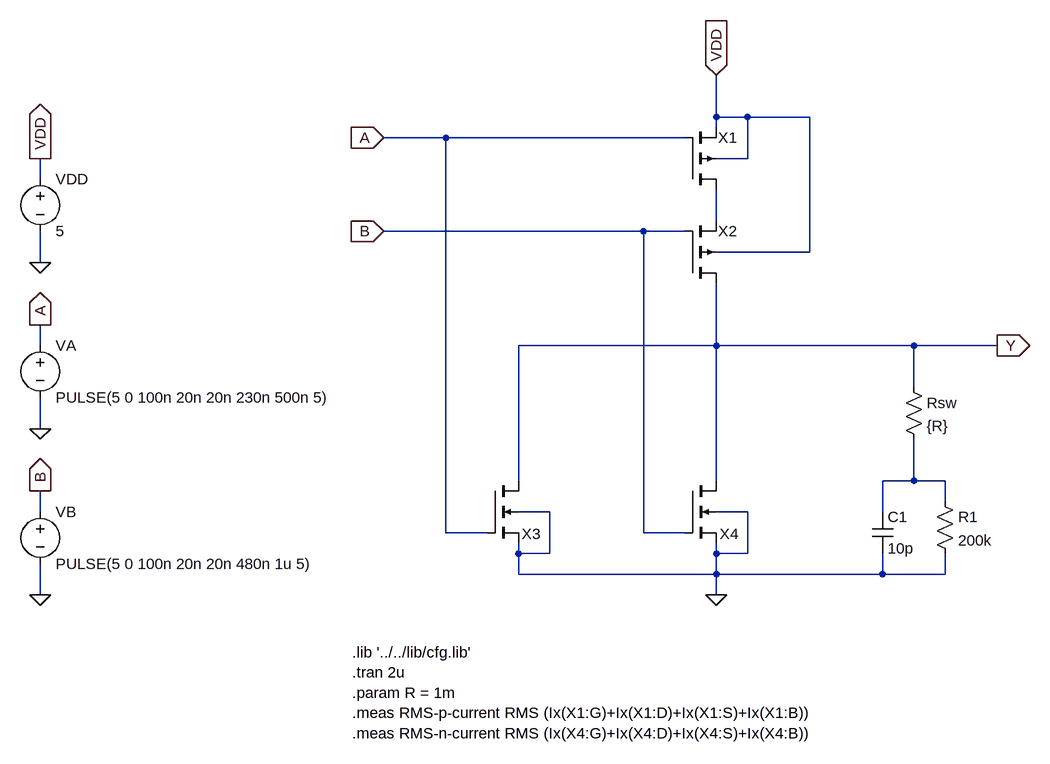
[diagram p0: schematic nor[pulse].asc]
nor[pulse].asc, the LTspice schematic file:
Version 4
SHEET 1 1500 680
WIRE 464 -304 464 -368
WIRE 512 -304 464 -304
WIRE 608 -304 512 -304
WIRE 464 -288 464 -304
WIRE 48 -272 -48 -272
WIRE 416 -272 48 -272
WIRE 512 -240 512 -304
WIRE 512 -240 464 -240
WIRE -576 -208 -576 -240
WIRE 464 -144 464 -192
WIRE 352 -128 -48 -128
WIRE 416 -128 352 -128
WIRE 608 -96 608 -304
WIRE 608 -96 464 -96
WIRE -576 -80 -576 -128
WIRE -576 48 -576 16
WIRE 464 48 464 -48
WIRE 464 48 160 48
WIRE 768 48 464 48
WIRE 896 48 768 48
WIRE 768 112 768 48
WIRE -576 176 -576 128
WIRE 160 256 160 48
WIRE 464 256 464 48
WIRE 768 256 768 192
WIRE 768 256 720 256
WIRE 816 256 768 256
WIRE 816 288 816 256
WIRE -576 304 -576 272
WIRE 208 304 160 304
WIRE 512 304 464 304
WIRE 720 304 720 256
WIRE 48 336 48 -272
WIRE 112 336 48 336
WIRE 352 336 352 -128
WIRE 416 336 352 336
WIRE 160 368 160 352
WIRE 208 368 208 304
WIRE 208 368 160 368
WIRE 464 368 464 352
WIRE 512 368 512 304
WIRE 512 368 464 368
WIRE 160 400 160 368
WIRE 464 400 464 368
WIRE 464 400 160 400
WIRE 720 400 720 368
WIRE 720 400 464 400
WIRE 816 400 816 368
WIRE 816 400 720 400
WIRE -576 432 -576 384
WIRE 464 432 464 400
FLAG 464 432 0
FLAG -576 -80 0
FLAG 896 48 Y
IOPIN 896 48 Out
FLAG -576 -240 VDD
IOPIN -576 -240 Out
FLAG 464 -368 VDD
IOPIN 464 -368 In
FLAG -576 272 B
IOPIN -576 272 Out
FLAG -576 432 0
FLAG -576 16 A
IOPIN -576 16 Out
FLAG -576 176 0
FLAG -48 -272 A
IOPIN -48 -272 In
FLAG -48 -128 B
IOPIN -48 -128 In
SYMBOL voltage -576 -224 R0
WINDOW 123 0 0 Left 2
WINDOW 39 0 0 Left 2
SYMATTR InstName VDD
SYMATTR Value 5
SYMBOL voltage -576 288 R0
WINDOW 123 0 0 Left 2
WINDOW 39 0 0 Left 2
SYMATTR InstName VB
SYMATTR Value PULSE(5 0 100n 20n 20n 480n 1u 5)
SYMBOL cap 704 304 R0
SYMATTR InstName C1
SYMATTR Value 10p
SYMBOL res 800 272 R0
SYMATTR InstName R1
SYMATTR Value 200k
SYMBOL voltage -576 32 R0
WINDOW 123 0 0 Left 2
WINDOW 39 0 0 Left 2
SYMATTR InstName VA
SYMATTR Value PULSE(5 0 100n 20n 20n 230n 500n 5)
SYMBOL pmos4 416 -192 M180
WINDOW 0 51 80 Left 2
WINDOW 3 52 23 Invisible 2
SYMATTR InstName X1
SYMATTR Value pmos_t1
SYMATTR Prefix X
SYMBOL nmos4 416 256 R0
WINDOW 0 53 82 Left 2
WINDOW 3 53 23 Invisible 2
SYMATTR InstName X4
SYMATTR Value nmos_t1
SYMATTR Prefix X
SYMBOL res 752 96 R0
SYMATTR InstName Rsw
SYMATTR Value {R}
SYMBOL pmos4 416 -48 M180
WINDOW 0 51 80 Left 2
WINDOW 3 52 23 Invisible 2
SYMATTR InstName X2
SYMATTR Value pmos_t1
SYMATTR Prefix X
SYMBOL nmos4 112 256 R0
WINDOW 0 53 82 Left 2
WINDOW 3 53 23 Invisible 2
SYMATTR InstName X3
SYMATTR Value nmos_t1
SYMATTR Prefix X
TEXT -96 520 Left 2 !.lib '../../lib/cfg.lib'\n.tran 2u\n.param R = 1m\n.meas RMS-p-current RMS (Ix(X1:G)+Ix(X1:D)+Ix(X1:S)+Ix(X1:B))\n.meas RMS-n-current RMS (Ix(X4:G)+Ix(X4:D)+Ix(X4:S)+Ix(X4:B))

The netlist it stands for:
* nor[pulse].asc
VDD VDD 0 5
VB B 0 PULSE(5 0 100n 20n 20n 480n 1u 5)
C1 N002 0 10p
R1 N002 0 200k
VA A 0 PULSE(5 0 100n 20n 20n 230n 500n 5)
XX1 N001 A VDD VDD pmos_t1  ; pins D G S B
XX4 Y B 0 0 nmos_t1  ; pins D G S B
Rsw Y N002 {R}
XX2 Y B N001 VDD pmos_t1  ; pins D G S B
XX3 Y A 0 0 nmos_t1  ; pins D G S B
.lib '../../lib/cfg.lib'
.tran 2u
.param R = 1m
.meas RMS-p-current RMS (Ix(X1:G)+Ix(X1:D)+Ix(X1:S)+Ix(X1:B))
.meas RMS-n-current RMS (Ix(X4:G)+Ix(X4:D)+Ix(X4:S)+Ix(X4:B))
.backanno
.end